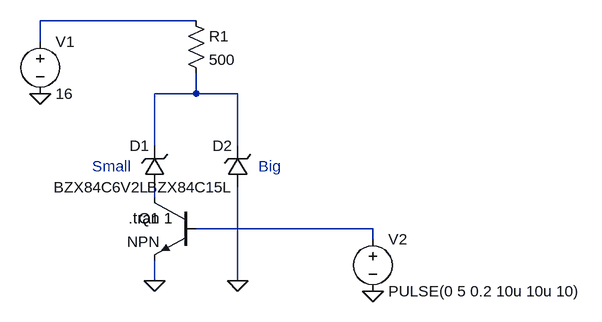
[diagram p0: schematic Draft4.asc]
Draft4.asc, the LTspice schematic file:
Version 4.1
SHEET 1 916 680
WIRE 304 -64 64 -64
WIRE 64 -32 64 -64
WIRE 304 48 304 16
WIRE 304 48 240 48
WIRE 368 48 304 48
WIRE 240 128 240 48
WIRE 368 128 368 48
WIRE 240 208 240 192
WIRE 576 256 304 256
WIRE 576 272 576 256
WIRE 240 336 240 304
WIRE 368 336 368 192
FLAG 64 48 0
FLAG 240 336 0
FLAG 368 336 0
FLAG 576 352 0
SYMBOL zener 256 192 R180
WINDOW 0 24 64 Left 2
WINDOW 3 24 0 Left 2
SYMATTR InstName D1
SYMATTR Value BZX84C6V2L
SYMBOL zener 384 192 R180
WINDOW 0 24 64 Left 2
WINDOW 3 24 0 Left 2
SYMATTR InstName D2
SYMATTR Value BZX84C15L
SYMBOL voltage 64 -48 R0
WINDOW 123 0 0 Left 0
WINDOW 39 0 0 Left 0
SYMATTR InstName V1
SYMATTR Value 16
SYMBOL res 288 -80 R0
SYMATTR InstName R1
SYMATTR Value 500
SYMBOL npn 304 208 M0
SYMATTR InstName Q1
SYMBOL voltage 576 256 R0
WINDOW 123 0 0 Left 0
WINDOW 39 0 0 Left 0
SYMATTR InstName V2
SYMATTR Value PULSE(0 5 0.2 10u 10u 10)
TEXT 200 240 Left 2 !.tran 1
TEXT 400 160 Left 2 ;Big
TEXT 144 160 Left 2 ;Small

The netlist it stands for:
* Draft4.asc
D1 N003 N002 BZX84C6V2L
D2 0 N002 BZX84C15L
V1 N001 0 16
R1 N001 N002 500
Q1 N003 N004 0 0 NPN
V2 N004 0 PULSE(0 5 0.2 10u 10u 10)
.model D D
.lib standard.dio
.model NPN NPN
.model PNP PNP
.lib standard.bjt
.tran 1
* Big
* Small
.backanno
.end